# Altium schematic sheet QWAVE-Stackup_Design_6Layer_3GHz.SchDoc
size A4
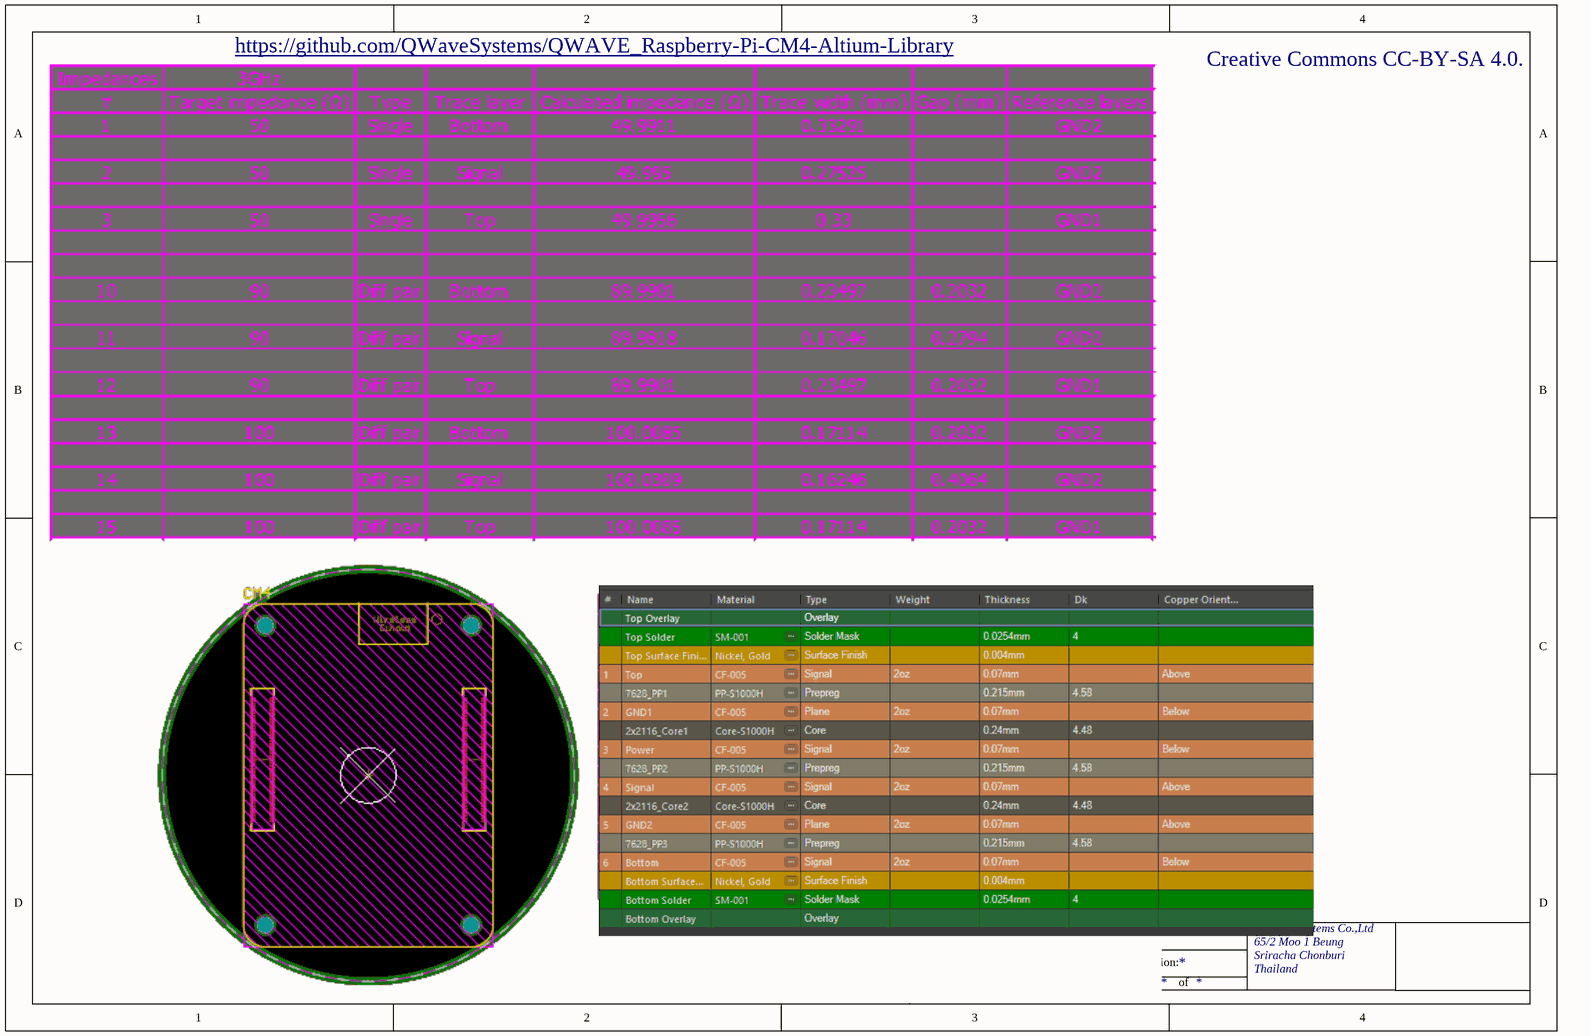
[diagram p0: QWAVE-Stackup_Design_6Layer_3GHz.SchDoc]

## Notes on the sheet
- https://github.com/QWaveSystems/QWAVE_Raspberry-Pi-CM4-Altium-Library
- Creative Commons CC-BY-SA 4.0.
- Title
- Size:
- Date:
- A4
- Number:
- Time:
- Revision:
- Sheet
- of
- Q-Wave Systems Co.,Ltd
- 65/2 Moo 1 Beung
- Sriracha Chonburi
- Thailand
- File: